# EAGLE design ping-pong-clock (EAGLE 5.03)
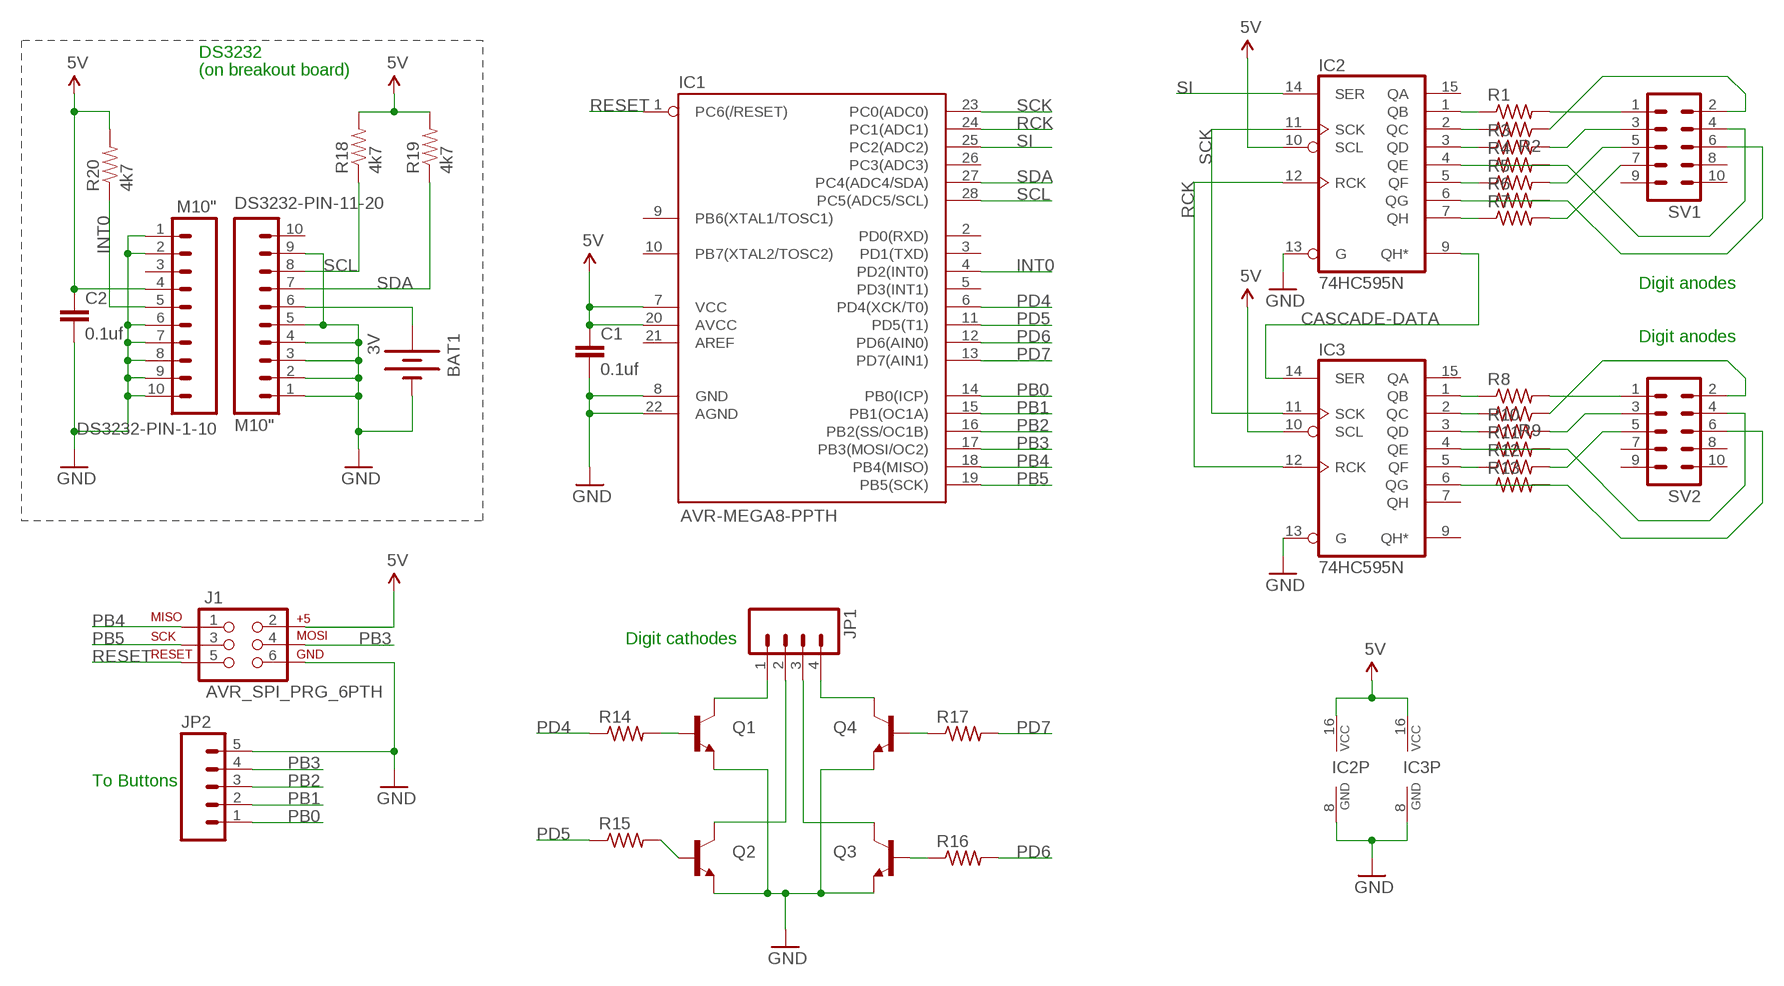
[diagram p0: schematic, sheet 1]

## Parts
BAT1  3V  BATTERY20PTH  [BATTCOM_20MM_PTH]
C1  0.1uf  CAPPTH  [CAP-PTH-SMALL]
C2  0.1uf  CAPPTH  [CAP-PTH-SMALL]
DS3232-PIN-1-10  M10"  [1X10]
DS3232-PIN-11-20  M10"  [1X10]
IC1  AVR-MEGA8-PPTH  [DIL28-3]
IC2  74HC595N  [DIL16]
IC3  74HC595N  [DIL16]
J1  AVR_SPI_PRG_6PTH  [2X3]
JP1  M04LONGPADS  [1X04_LONGPADS]
JP2  M05PTH_LONGPADS  [1X05_LONGPADS]
Q1  TRANSISTOR_NPNTO92  [TO-92]
Q2  TRANSISTOR_NPNTO92  [TO-92]
Q3  TRANSISTOR_NPNTO92  [TO-92]
Q4  TRANSISTOR_NPNTO92  [TO-92]
R1  R-US_0309/V  [0309V]
R2  R-US_0309/V  [0309V]
R3  R-US_0309/V  [0309V]
R4  R-US_0309/V  [0309V]
R5  R-US_0309/V  [0309V]
R6  R-US_0309/V  [0309V]
R7  R-US_0309/V  [0309V]
R8  R-US_0309/V  [0309V]
R9  R-US_0309/V  [0309V]
R10  R-US_0309/V  [0309V]
R11  R-US_0309/V  [0309V]
R12  R-US_0309/V  [0309V]
R13  R-US_0309/V  [0309V]
R14  R-US_0207/10  [0207/10]
R15  R-US_0207/10  [0207/10]
R16  R-US_0207/10  [0207/10]
R17  R-US_0207/10  [0207/10]
R18  4k7  RESISTORPTH1  [AXIAL-0.3]
R19  4k7  RESISTORPTH1  [AXIAL-0.3]
R20  4k7  RESISTORPTH1  [AXIAL-0.3]
SV1  MA05-2  [MA05-2]
SV2  MA05-2  [MA05-2]

## Nets
5V: C1.1 C2.1 DS3232-PIN-1-10.4 IC1.7(VCC) IC1.20(AVCC) IC2.10(SCL) IC2.16(VCC) IC3.10(SCL) IC3.16(VCC) J1.2 R18.P$2 R19.P$2 R20.P$2
CASCADE-DATA: IC2.9(QH*) IC3.14(SER)
GND: BAT1.2(-) C1.2 C2.2 DS3232-PIN-1-10.1 DS3232-PIN-1-10.2 DS3232-PIN-1-10.6 DS3232-PIN-1-10.7 DS3232-PIN-1-10.8 DS3232-PIN-1-10.9 DS3232-PIN-1-10.10 DS3232-PIN-11-20.1 DS3232-PIN-11-20.2 DS3232-PIN-11-20.3 DS3232-PIN-11-20.4 DS3232-PIN-11-20.5 DS3232-PIN-11-20.9 IC1.8(GND) IC1.22(AGND) IC2.8(GND) IC2.13(G) IC3.8(GND) IC3.13(G) J1.6 JP2.5 Q1.1(E) Q2.1(E) Q3.1(E) Q4.1(E)
INT0: DS3232-PIN-1-10.5 IC1.4(PD2(INT0)) R20.P$1
N$1: BAT1.1(+) DS3232-PIN-11-20.6
N$2: IC2.1(QB) R1.1
N$3: IC2.2(QC) R2.2
N$4: IC2.3(QD) R3.1
N$5: IC2.4(QE) R4.2
N$6: IC2.5(QF) R5.1
N$7: IC2.6(QG) R6.2
N$8: IC2.7(QH) R7.1
N$9: IC3.1(QB) R8.1
N$10: IC3.2(QC) R9.2
N$11: IC3.3(QD) R10.1
N$12: IC3.4(QE) R11.2
N$13: IC3.5(QF) R12.1
N$14: IC3.6(QG) R13.2
N$15: R1.2 SV1.1
N$16: R3.2 SV1.3
N$17: R2.1 SV1.2
N$18: R5.2 SV1.5
N$19: R7.2 SV1.7
N$20: R4.1 SV1.4
N$21: R6.1 SV1.6
N$22: R8.2 SV2.1
N$23: R9.1 SV2.2
N$24: R10.2 SV2.3
N$25: R12.2 SV2.5
N$26: R11.1 SV2.4
N$27: R13.1 SV2.6
N$28: JP1.1 Q1.3(C)
N$29: JP1.4 Q4.3(C)
N$30: JP1.2 Q2.3(C)
N$31: JP1.3 Q3.3(C)
N$35: Q1.2(B) R14.2
N$36: Q2.2(B) R15.2
N$37: Q4.2(B) R17.1
N$38: Q3.2(B) R16.1
PB0: IC1.14(PB0(ICP)) JP2.1
PB1: IC1.15(PB1(OC1A)) JP2.2
PB2: IC1.16(PB2(SS/OC1B)) JP2.3
PB3: IC1.17(PB3(MOSI/OC2)) J1.4 JP2.4
PB4: IC1.18(PB4(MISO)) J1.1
PB5: IC1.19(PB5(SCK)) J1.3
PD4: IC1.6(PD4(XCK/T0)) R14.1
PD5: IC1.11(PD5(T1)) R15.1
PD6: IC1.12(PD6(AIN0)) R16.2
PD7: IC1.13(PD7(AIN1)) R17.2
RCK: IC1.24(PC1(ADC1)) IC2.12(RCK) IC3.12(RCK)
RESET: IC1.1(PC6(/RESET)) J1.5
SCK: IC1.23(PC0(ADC0)) IC2.11(SCK) IC3.11(SCK)
SCL: DS3232-PIN-11-20.8 IC1.28(PC5(ADC5/SCL)) R18.P$1
SDA: DS3232-PIN-11-20.7 IC1.27(PC4(ADC4/SDA)) R19.P$1
SI: IC1.25(PC2(ADC2)) IC2.14(SER)
Unconnected: DS3232-PIN-1-10.3 DS3232-PIN-11-20.10 IC1.2(PD0(RXD)) IC1.3(PD1(TXD)) IC1.5(PD3(INT1)) IC1.9(PB6(XTAL1/TOSC1)) IC1.10(PB7(XTAL2/TOSC2)) IC1.21(AREF) IC1.26(PC3(ADC3)) IC2.15(QA) IC3.7(QH) IC3.9(QH*) IC3.15(QA) SV1.8 SV1.9 SV1.10 SV2.7 SV2.8 SV2.9 SV2.10

## Notes on the sheet
- DS3232
- (on breakout board)
- Digit anodes
- Digit anodes
- Digit cathodes
- To Buttons

## Library data of the parts
BAT1 = SparkFun:BATTERY: Battery Holders Various common sizes : AA, AAA, 20mm coin cell and 12mm coin cell.
C1 C2 = SparkFun:CAP: Capacitor Standard 0603 ceramic capacitor, and 0.1" leaded capacitor.
DS3232-PIN-1-10 DS3232-PIN-11-20 = SparkFun:M10: Header 10 Standard 10-pin 0.1" header. Use with straight break away headers (SKU : PRT-00116), right angle break away headers (PRT-00553), swiss pins (PRT-00743), machine pins (PRT-00117), and female headers (PRT-00115).
IC1 = SparkFun:AVR-MEGA8-P: MICROCONTROLLER 8 Kbytes FLASH 1 kbytes SRAM 512 bytes EEPROM USART 4-channel 10 bit ADC 2-channel 8 bit ADC
IC2 IC3 = 74xx-eu:74*595: 8-bit SHIFT REGISTER, output latch
J1 = SparkFun:AVR_SPI_PRG_6: AVR ISP 6 Pin This is the reduced ISP connector for AVR programming. Common on Arduino. This footprint will take up less PCB space and can be used with a 10-pin to 6-pin adapter such as SKU: BOB-08508
JP1 = SparkFun:M04: Header 4 Standard 4-pin 0.1" header. Use with straight break away headers (SKU : PRT-00116), right angle break away headers (PRT-00553), swiss pins (PRT-00743), machine pins (PRT-00117), and female headers (PRT-00115). Molex polarized connector foot print use with SKU : PRT-08231 with associated crimp pins and housings.
JP2 = SparkFun:M05: Header 5 Standard 5-pin 0.1" header. Use with straight break away headers (SKU : PRT-00116), right angle break away headers (PRT-00553), swiss pins (PRT-00743), machine pins (PRT-00117), and female headers (PRT-00115). Molex polarized connector foot print use with SKU : PRT-08230 with associated crimp pins and housings.
Q1-Q4 = SparkFun:TRANSISTOR_NPN: Transistor NPN BJT configuration in SOT23 package. MMBT2222 is the common NPN we use. Double check BCE configuration again layout.
R1-R17 = resistor:R-US_: RESISTOR, American symbol
R18-R20 = SparkFun:RESISTOR: Resistor Basic schematic elements and footprints for 0603, 1206, and PTH 1/10th watt (small) resistors.
SV1 SV2 = con-lstb:MA05-2: PIN HEADER

## Board
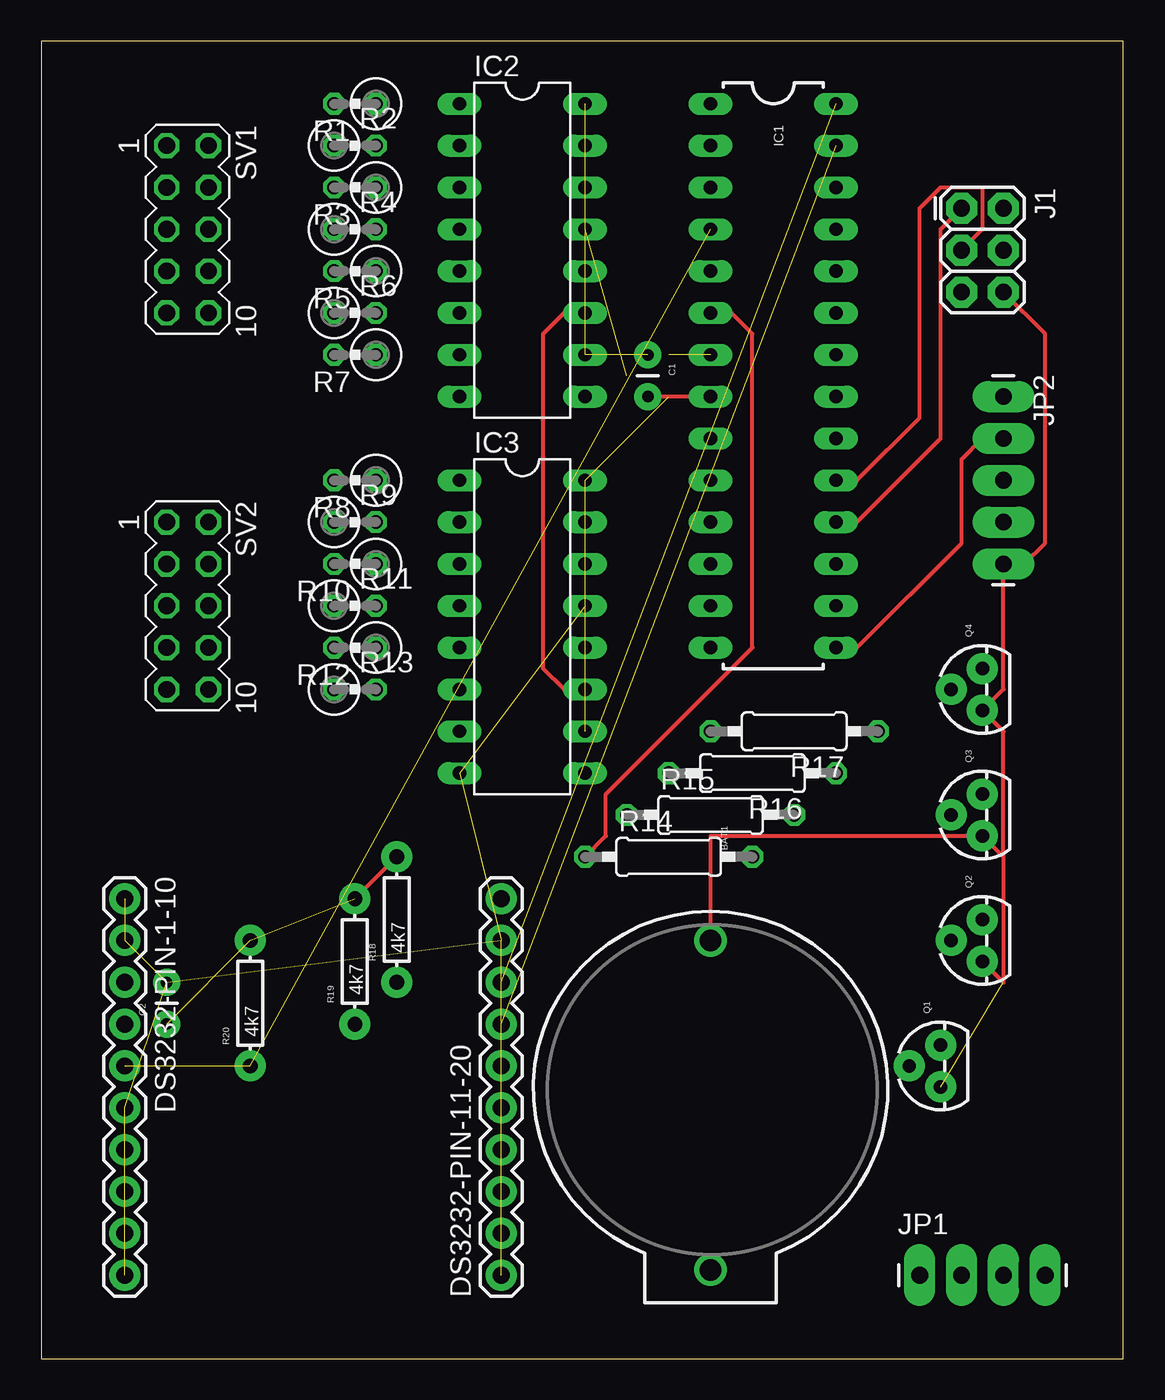
[diagram p1: board, top side]
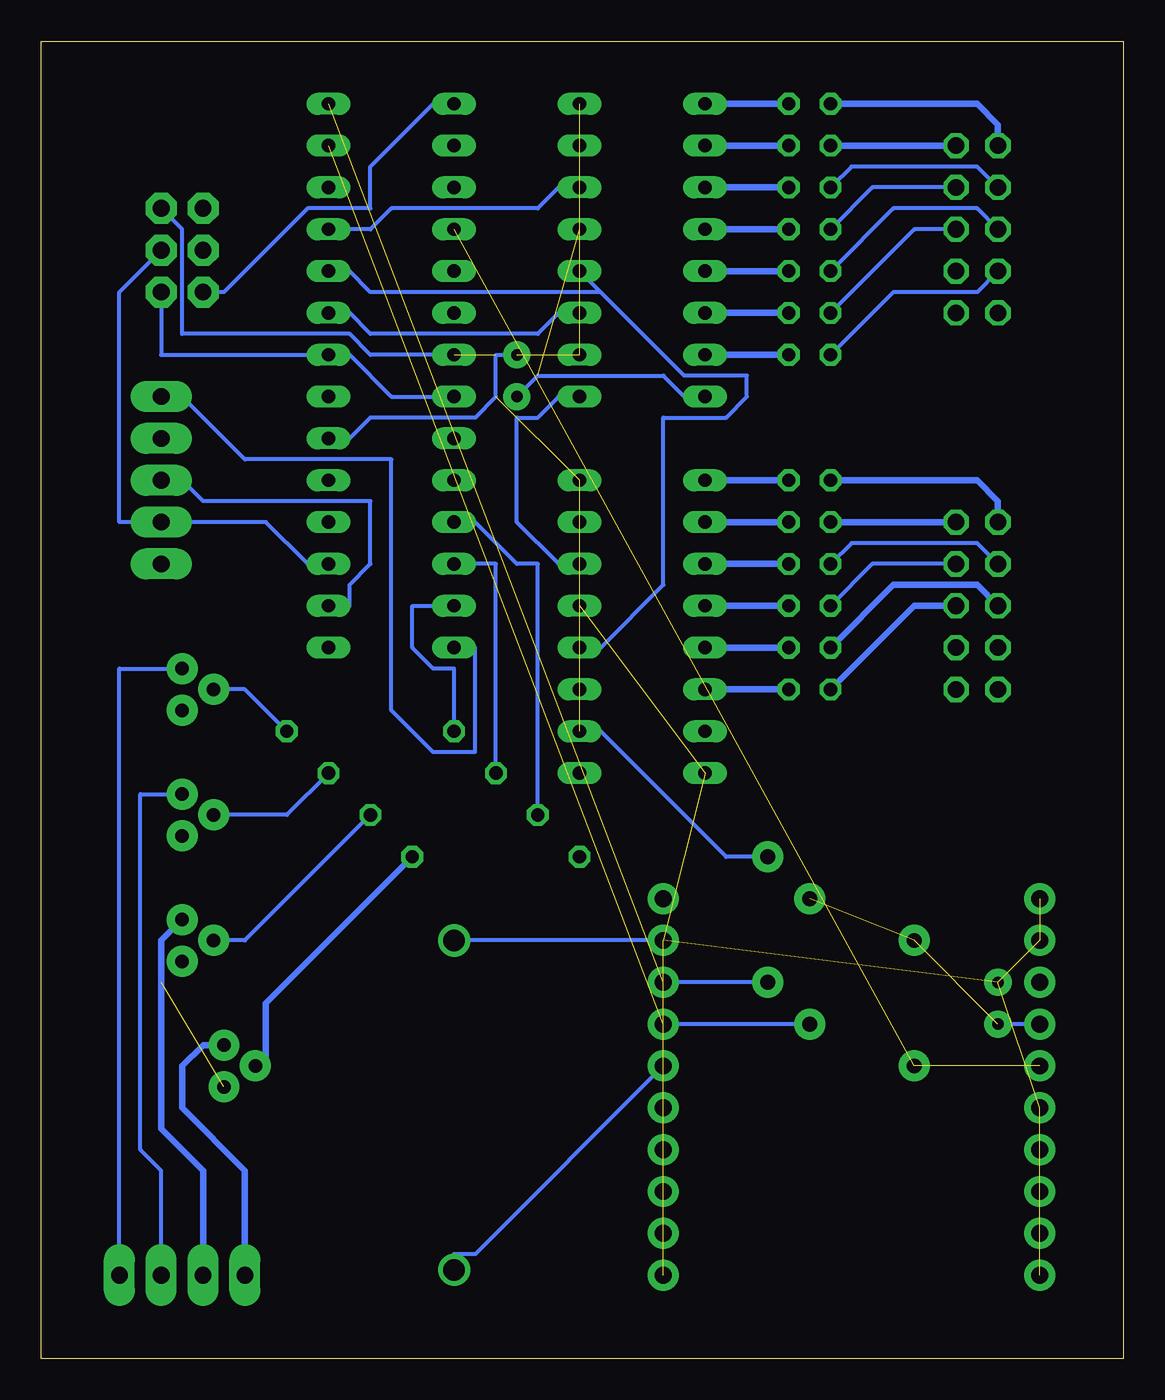
[diagram p2: board, bottom side, seen from below]

Size 65.71 x 80 mm. Coordinates in mm from the lower left corner, seen from the top.
Outline: 0,0 65.71,0 65.71,80 0,80 0,0
Copper layers (1*16): Top 0.035mm / dielectric 1.5mm / Bottom 0.035mm
Design rules "default": minimum track width 10mil, minimum drill 24mil, track to track 8mil, track to pad 8mil, pad to pad 8mil, via to via 8mil, smd to smd 8mil, copper to edge 40mil, drill to drill 8mil, minimum pad ring 10mil, minimum via ring 8mil, stop-mask expansion 4mil, vias tented up to drill 0mil, thermal gap 10mil

### Footprints (pad centres in the part's own frame; a part is rotated, then mirrored left to right if it is on the bottom)
BATTCOM_20MM_PTH = drill 1.3 round: 1 20,0; 2 0,0
CAP-PTH-SMALL = drill 0.7 pad 1.651 round: 1 0,0; 2 2.54,0
1X10 = drill 1.016 pad 1.88 round: 1 0,0; 2 2.54,0; 3 5.08,0; 4 7.62,0; 5 10.16,0; 6 12.7,0; 7 15.24,0; 8 17.78,0; 9 20.32,0; 10 22.86,0
DIL28-3 = drill 0.813 long: 1 -16.51,-3.81; 2 -13.97,-3.81; 3 -11.43,-3.81; 4 -8.89,-3.81; 5 -6.35,-3.81; 6 -3.81,-3.81; 7 -1.27,-3.81; 8 1.27,-3.81; 9 3.81,-3.81; 10 6.35,-3.81; 11 8.89,-3.81; 12 11.43,-3.81; 13 13.97,-3.81; 14 16.51,-3.81; 15 16.51,3.81; 16 13.97,3.81; 17 11.43,3.81; 18 8.89,3.81; 19 6.35,3.81; 20 3.81,3.81; 21 1.27,3.81; 22 -1.27,3.81; 23 -3.81,3.81; 24 -6.35,3.81; 25 -8.89,3.81; 26 -11.43,3.81; 27 -13.97,3.81; 28 -16.51,3.81
DIL16 = drill 0.813 long: 1 -8.89,-3.81; 2 -6.35,-3.81; 3 -3.81,-3.81; 4 -1.27,-3.81; 5 1.27,-3.81; 6 3.81,-3.81; 7 6.35,-3.81; 8 8.89,-3.81; 9 8.89,3.81; 10 6.35,3.81; 11 3.81,3.81; 12 1.27,3.81; 13 -1.27,3.81; 14 -3.81,3.81; 15 -6.35,3.81; 16 -8.89,3.81
2X3 = drill 1.016 pad 1.88 octagon: 1 0,0; 2 0,2.54; 3 2.54,0; 4 2.54,2.54; 5 5.08,0; 6 5.08,2.54
1X04_LONGPADS = drill 1.016 pad 1.88 long: 1 0,0; 2 2.54,0; 3 5.08,0; 4 7.62,0
1X05_LONGPADS = drill 1.016 pad 1.88 long: 1 0,0; 2 2.54,0; 3 5.08,0; 4 7.62,0; 5 10.16,0
TO-92 = drill 0.813 pad 1.88 round: 1 -1.27,0; 2 0,1.905; 3 1.27,0
0309V = drill 0.813 octagon: 1 -1.27,0; 2 1.27,0
0207/10 = drill 0.813 octagon: 1 -5.08,0; 2 5.08,0
AXIAL-0.3 = drill 0.9 pad 1.88 round: P$1 -3.81,0; P$2 3.81,0
MA05-2 = drill 1.016 octagon: 1 -5.08,-1.27; 2 -5.08,1.27; 3 -2.54,-1.27; 4 -2.54,1.27; 5 0,-1.27; 6 0,1.27; 7 2.54,-1.27; 8 2.54,1.27; 9 5.08,-1.27; 10 5.08,1.27

### Placement (x,y rotation side)
BAT1  40.64,25.4 270 top
C1  36.83,60.96 270 top
C2  7.62,20.32 90 top
DS3232-PIN-1-10  5.08,27.94 270 top
DS3232-PIN-11-20  27.94,5.08 90 top
IC1  44.45,59.69 270 top
IC2  29.21,67.31 270 top
IC3  29.21,44.45 270 top
J1  55.88,69.85 270 top
JP1  53.34,5.08 0 top
JP2  58.42,58.42 270 top
Q1  54.61,17.78 90 top
Q2  57.15,25.4 90 top
Q3  57.15,33.02 90 top
Q4  57.15,40.64 90 top
R1  19.05,76.2 180 top
R2  19.05,73.66 0 top
R3  19.05,71.12 180 top
R4  19.05,68.58 0 top
R5  19.05,66.04 180 top
R6  19.05,63.5 0 top
R7  19.05,60.96 180 top
R8  19.05,53.34 180 top
R9  19.05,50.8 0 top
R10  19.05,48.26 180 top
R11  19.05,45.72 0 top
R12  19.05,43.18 180 top
R13  19.05,40.64 0 top
R14  38.1,30.48 0 top
R15  40.64,33.02 0 top
R16  43.18,35.56 180 top
R17  45.72,38.1 180 top
R18  21.59,26.67 90 top
R19  19.05,24.13 90 top
R20  12.7,21.59 90 top
SV1  8.89,68.58 270 top
SV2  8.89,45.72 270 top

### Tracks (layer width: path | path; a pad name or v marks a point on that pad's centre or on a via)
5V  (7 unrouted)
  Top 0.254: R19.P$2 R18.P$2
  Bottom 0.254: R18.P$2 24.13,30.48 31.75,38.1 IC3.10 | C1.1 38.1,60.96 38.1,58.42 39.37,57.15 45.72,57.15 46.99,55.88 IC1.20 | J1.2 57.15,68.58 57.15,62.23 46.99,62.23 45.72,60.96 IC1.7 | DS3232-PIN-1-10.4 C2.1
CASCADE-DATA
  Bottom 0.254: IC3.14 34.29,48.26 36.83,50.8 36.83,57.15 35.56,57.15 34.29,58.42 IC2.9
GND  (17 unrouted)
  Top 0.254: IC1.8 C1.2 | Q2.1 58.42,22.86 58.42,30.48 | 58.42,30.48 Q3.1 40.64,31.75 BAT1.2 | 58.42,30.48 58.42,38.1 Q4.1 58.42,40.64 JP2.5 59.69,48.26 60.96,49.53 60.96,62.23 J1.6
  Bottom 0.254: C1.2 35.56,59.69 27.94,59.69 26.67,58.42 IC2.8 | IC1.8 44.45,58.42 46.99,60.96 IC1.22 58.42,60.96 J1.6 | DS3232-PIN-11-20.9 BAT1.2
INT0  (2 unrouted)
N$1
  Bottom 0.254: DS3232-PIN-11-20.6 39.37,6.35 40.64,6.35 BAT1.1
N$2
  Bottom 0.406: R1.1 IC2.1
N$3
  Bottom 0.406: R2.2 IC2.2
N$4
  Bottom 0.406: R3.1 IC2.3
N$5
  Bottom 0.406: R4.2 IC2.4
N$6
  Bottom 0.406: R5.1 IC2.5
N$7
  Bottom 0.406: R6.2 IC2.6
N$8
  Bottom 0.406: R7.1 IC2.7
N$9
  Bottom 0.406: R8.1 IC3.1
N$10
  Bottom 0.406: R9.2 IC3.2
N$11
  Bottom 0.406: R10.1 IC3.3
N$12
  Bottom 0.406: R11.2 IC3.4
N$13
  Bottom 0.406: R12.1 IC3.5
N$14
  Bottom 0.406: R13.2 IC3.6
N$15
  Bottom 0.406: SV1.1 7.62,74.93 8.89,76.2 R1.2
N$16
  Bottom 0.254: R3.2 16.51,72.39 8.89,72.39 SV1.3
N$17
  Bottom 0.406: SV1.2 R2.1
N$18
  Bottom 0.254: R5.2 13.97,69.85 8.89,69.85 SV1.5
N$19
  Bottom 0.254: R7.2 13.97,64.77 8.89,64.77 SV1.7
N$20
  Bottom 0.254: R4.1 15.24,71.12 SV1.4
N$21
  Bottom 0.254: R6.1 12.7,68.58 SV1.6
N$22
  Bottom 0.406: SV2.1 7.62,52.07 8.89,53.34 R8.2
N$23
  Bottom 0.406: SV2.2 R9.1
N$24
  Bottom 0.254: R10.2 16.51,49.53 8.89,49.53 SV2.3
N$25
  Bottom 0.406: SV2.5 8.89,46.99 13.97,46.99 R12.2
N$26
  Bottom 0.254: R11.1 15.24,48.26 SV2.4
N$27
  Bottom 0.406: R13.1 12.7,45.72 SV2.6
N$28
  Bottom 0.406: JP1.1 53.34,11.43 57.15,15.24 57.15,17.78 55.88,19.05 Q1.3
N$29
  Bottom 0.254: Q4.3 60.96,41.91 JP1.4
N$30
  Bottom 0.406: JP1.2 55.88,11.43 58.42,13.97 58.42,25.4 Q2.3
N$31
  Bottom 0.254: Q3.3 59.69,34.29 59.69,12.7 58.42,11.43 JP1.3
N$35
  Bottom 0.406: R14.2 52.07,21.59 52.07,18.41 Q1.2
N$36
  Bottom 0.254: R15.2 53.34,25.4 Q2.2
N$37
  Bottom 0.254: R17.1 53.34,40.64 Q4.2
N$38
  Bottom 0.254: R16.1 50.8,33.02 Q3.2
PB0
  Bottom 0.254: IC1.14 39.37,43.18 39.37,36.83 41.91,36.83 44.45,39.37 44.45,54.61 53.34,54.61 57.15,58.42 JP2.1
PB1
  Top 0.254: IC1.15 49.53,43.18 55.88,49.53 55.88,54.61 57.15,55.88 JP2.2
PB2
  Bottom 0.254: IC1.16 46.99,45.72 46.99,46.99 45.72,48.26 45.72,52.07 55.88,52.07 57.15,53.34 JP2.3
PB3
  Bottom 0.254: IC1.17 49.53,48.26 52.07,50.8 JP2.4 60.96,50.8 60.96,64.77 J1.4
PB4
  Top 0.254: J1.1 54.61,68.58 54.61,55.88 49.53,50.8 IC1.18
PB5
  Top 0.254: J1.3 57.15,68.58 57.15,71.12 54.61,71.12 53.34,69.85 53.34,57.15 49.53,53.34 IC1.19
PD4
  Top 0.254: R14.1 34.29,31.75 34.29,34.29 43.18,43.18 43.18,62.23 41.91,63.5 IC1.6
PD5
  Bottom 0.254: R15.1 35.56,48.26 36.83,48.26 39.37,50.8 IC1.11
PD6
  Bottom 0.254: R16.2 38.1,48.26 IC1.12
PD7
  Bottom 0.254: R17.2 40.64,41.91 41.91,41.91 43.18,43.18 43.18,45.72 IC1.13
RCK
  Bottom 0.254: 31.75,64.77 IC2.12 | 31.75,64.77 26.67,59.69 22.86,59.69 22.86,58.42 24.13,57.15 27.94,57.15 27.94,46.99 31.75,43.18 IC3.12 | 31.75,64.77 45.72,64.77 46.99,66.04 IC1.24
RESET
  Bottom 0.254: J1.5 54.61,64.77 49.53,69.85 45.72,69.85 45.72,72.39 41.91,76.2 IC1.1
SCK
  Top 0.254: IC3.11 31.75,40.64 30.48,41.91 30.48,62.23 31.75,63.5 IC2.11
  Bottom 0.254: IC1.23 46.99,63.5 45.72,62.23 35.56,62.23 34.29,63.5 IC2.11
SCL  (1 unrouted)
  Bottom 0.254: R18.P$1 DS3232-PIN-11-20.8
SDA  (1 unrouted)
  Bottom 0.254: R19.P$1 DS3232-PIN-11-20.7
SI
  Bottom 0.254: IC2.14 34.29,71.12 35.56,69.85 44.45,69.85 45.72,68.58 IC1.25